# Altium schematic sheet PwrAndBias.SchDoc: Pwr And Biasing
size A3; Revision: 1; SheetNumber: 8
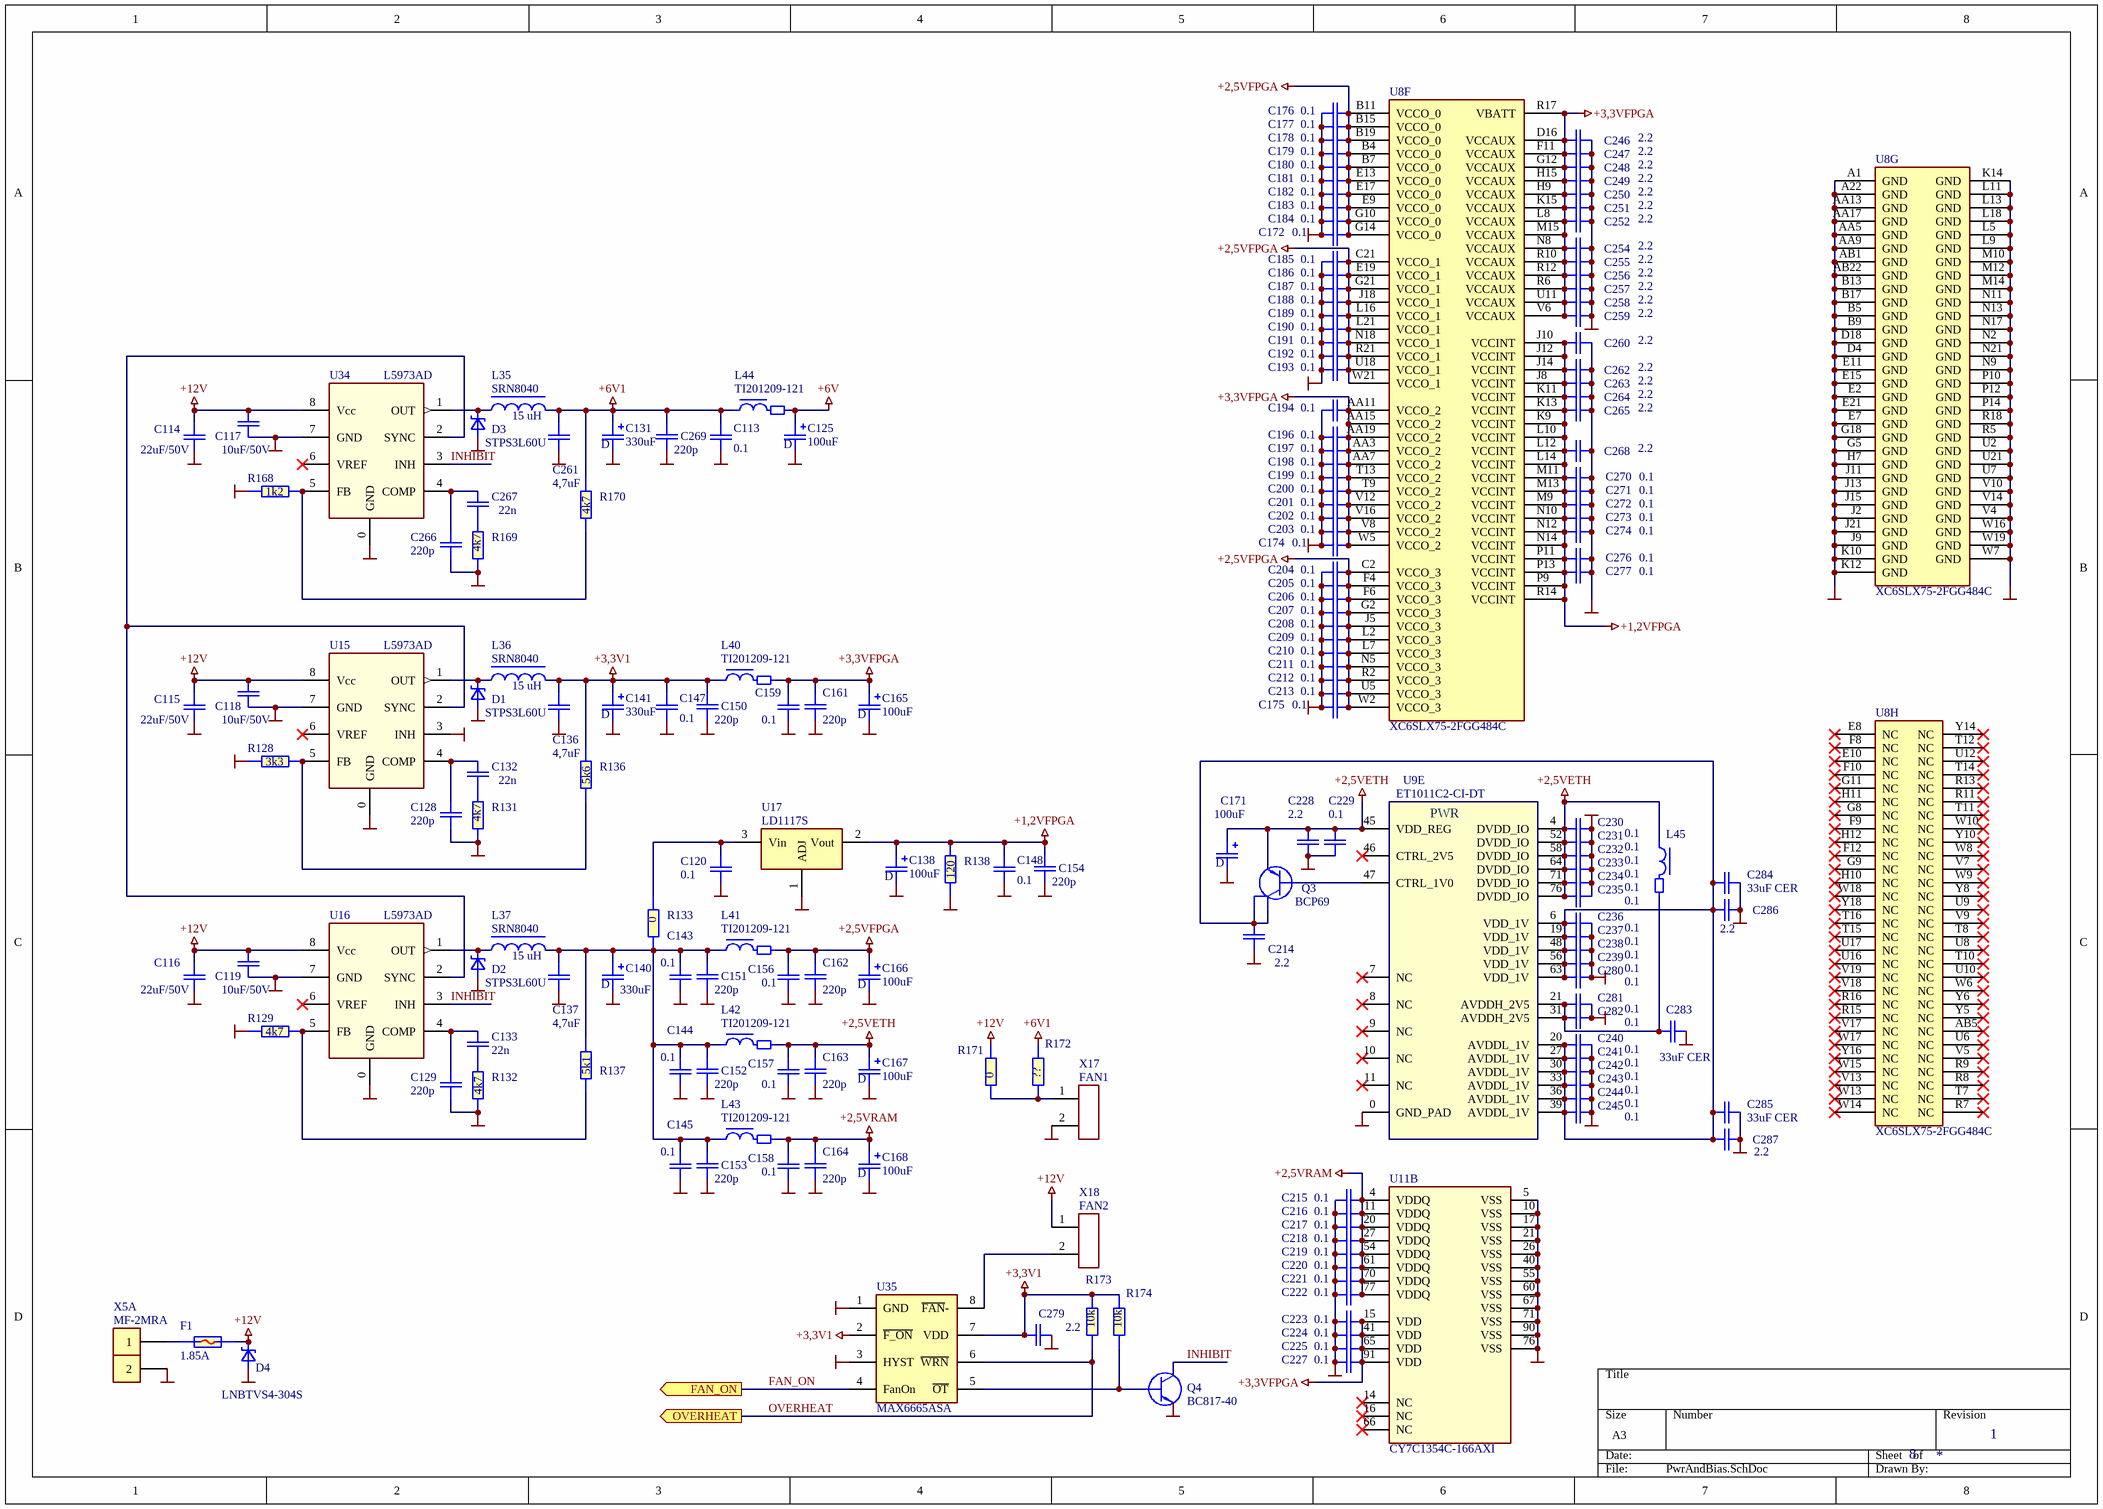
[diagram p0: PwrAndBias.SchDoc]

## Parts
C113  0.1  [C0402-Phillips]
C114  22uF/50V  [C2220]
C115  22uF/50V  [C2220]
C116  22uF/50V  [C2220]
C117  10uF/50V  [C1210_H2,5]
C118  10uF/50V  [C1210_H2,5]
C119  10uF/50V  [C1210_H2,5]
C120  0.1  [C0402-Phillips]
C125  100uF  [cd7343]
C128  220p  [C0603-PHILLIPS]
C129  220p  [C0603-PHILLIPS]
C131  330uF  [cd7343]
C132  22n  [C0603-PHILLIPS]
C133  22n  [C0603-PHILLIPS]
C136  4,7uF  [c1206]
C137  4,7uF  [c1206]
C138  100uF  [cd7343]
C140  330uF  [cd7343]
C141  330uF  [cd7343]
C143  0.1  [C0402-Phillips]
C144  0.1  [C0402-Phillips]
C145  0.1  [C0402-Phillips]
C147  0.1  [C0402-Phillips]
C148  0.1  [C0402-Phillips]
C150  220p  [C0603-PHILLIPS]
C151  220p  [C0603-PHILLIPS]
C152  220p  [C0603-PHILLIPS]
C153  220p  [C0603-PHILLIPS]
C154  220p  [C0603-PHILLIPS]
C156  0.1  [C0402-Phillips]
C157  0.1  [C0402-Phillips]
C158  0.1  [C0402-Phillips]
C159  0.1  [C0402-Phillips]
C161  220p  [C0603-PHILLIPS]
C162  220p  [C0603-PHILLIPS]
C163  220p  [C0603-PHILLIPS]
C164  220p  [C0603-PHILLIPS]
C165  100uF  [cd7343]
C166  100uF  [cd7343]
C167  100uF  [cd7343]
C168  100uF  [cd7343]
C171  100uF  [cd7343]
C172  0.1  [C0402-cirq]
C174  0.1  [C0402-cirq]
C175  0.1  [C0402-cirq]
C176  0.1  [C0402-cirq]
C177  0.1  [C0402-cirq]
C178  0.1  [C0402-cirq]
C179  0.1  [C0402-cirq]
C180  0.1  [C0402-cirq]
C181  0.1  [C0402-cirq]
C182  0.1  [C0402-cirq]
C183  0.1  [C0402-cirq]
C184  0.1  [C0402-cirq]
C185  0.1  [C0402-cirq]
C186  0.1  [C0402-cirq]
C187  0.1  [C0402-cirq]
C188  0.1  [C0402-cirq]
C189  0.1  [C0402-cirq]
C190  0.1  [C0402-cirq]
C191  0.1  [C0402-cirq]
C192  0.1  [C0402-cirq]
C193  0.1  [C0402-cirq]
C194  0.1  [C0402-cirq]
C196  0.1  [C0402-cirq]
C197  0.1  [C0402-cirq]
C198  0.1  [C0402-cirq]
C199  0.1  [C0402-cirq]
C200  0.1  [C0402-cirq]
C201  0.1  [C0402-cirq]
C202  0.1  [C0402-cirq]
C203  0.1  [C0402-cirq]
C204  0.1  [C0402-cirq]
C205  0.1  [C0402-cirq]
C206  0.1  [C0402-cirq]
C207  0.1  [C0402-cirq]
C208  0.1  [C0402-cirq]
C209  0.1  [C0402-cirq]
C210  0.1  [C0402-cirq]
C211  0.1  [C0402-cirq]
C212  0.1  [C0402-cirq]
C213  0.1  [C0402-cirq]
C214  2.2  [C0402-Phillips]
C215  0.1  [C0402-Phillips]
C216  0.1  [C0402-Phillips]
C217  0.1  [C0402-Phillips]
C218  0.1  [C0402-Phillips]
C219  0.1  [C0402-Phillips]
C220  0.1  [C0402-Phillips]
C221  0.1  [C0402-Phillips]
C222  0.1  [C0402-Phillips]
C223  0.1  [C0402-Phillips]
C224  0.1  [C0402-Phillips]
C225  0.1  [C0402-Phillips]
C227  0.1  [C0402-Phillips]
C228  2.2  [C0402-Phillips]
C229  0.1  [C0402-Phillips]
C230  0.1  [C0402-Phillips]
C231  0.1  [C0402-Phillips]
C232  0.1  [C0402-Phillips]
C233  0.1  [C0402-Phillips]
C234  0.1  [C0402-Phillips]
C235  0.1  [C0402-Phillips]
C236  0.1  [C0402-Phillips]
C237  0.1  [C0402-Phillips]
C238  0.1  [C0402-Phillips]
C239  0.1  [C0402-Phillips]
C240  0.1  [C0402-Phillips]
C241  0.1  [C0402-Phillips]
C242  0.1  [C0402-Phillips]
C243  0.1  [C0402-Phillips]
C244  0.1  [C0402-Phillips]
C245  0.1  [C0402-Phillips]
C246  2.2  [C0402-cirq]
C247  2.2  [C0402-cirq]
C248  2.2  [C0402-cirq]
C249  2.2  [C0402-cirq]
C250  2.2  [C0402-cirq]
C251  2.2  [C0402-cirq]
C252  2.2  [C0402-cirq]
C254  2.2  [C0402-cirq]
C255  2.2  [C0402-cirq]
C256  2.2  [C0402-cirq]
C257  2.2  [C0402-cirq]
C258  2.2  [C0402-cirq]
C259  2.2  [C0402-cirq]
C260  2.2  [C0402-cirq]
C261  4,7uF  [c1206]
C262  2.2  [C0402-cirq]
C263  2.2  [C0402-cirq]
C264  2.2  [C0402-cirq]
C265  2.2  [C0402-cirq]
C266  220p  [C0603-PHILLIPS]
C267  22n  [C0603-PHILLIPS]
C268  2.2  [C0402-cirq]
C269  220p  [C0603-PHILLIPS]
C270  0.1  [C0402-cirq]
C271  0.1  [C0402-cirq]
C272  0.1  [C0402-cirq]
C273  0.1  [C0402-cirq]
C274  0.1  [C0402-cirq]
C276  0.1  [C0402-cirq]
C277  0.1  [C0402-cirq]
C279  2.2  [C0402-Phillips]
C280  0.1  [C0402-Phillips]
C281  0.1  [C0402-Phillips]
C282  0.1  [C0402-Phillips]
C283  33uF CER  [C0805-Phillips]
C284  33uF CER  [C0805-Phillips]
C285  33uF CER  [C0805-Phillips]
C286  2.2  [C0402-Phillips]
C287  2.2  [C0402-Phillips]
D1  STPS3L60U  [SMB]
D2  STPS3L60U  [SMB]
D3  STPS3L60U  [SMB]
D4  LNBTVS4-304S  [SMC]
F1  1.85A  [FUSE2920]
L35  15 uH  [SRN8040]
L36  15 uH  [SRN8040]
L37  15 uH  [SRN8040]
L40  TI201209-121  [TI2012-Phillips]
L41  TI201209-121  [TI2012-Phillips]
L42  TI201209-121  [TI2012-Phillips]
L43  TI201209-121  [TI2012-Phillips]
L44  TI201209-121  [TI2012-Phillips]
L45  TI160808U601  [Ti160808-Phillips]  (value not drawn)
Q3  BCP69  [SOT-223]
Q4  BC817-40  [SOT23-Philips]
R128  3k3  [R0603-PHILLIPS]
R129  4k7  [R0603-PHILLIPS]
R131  4k7  [R0603-PHILLIPS]
R132  4k7  [R0603-PHILLIPS]
R133  0  [R0603-PHILLIPS]
R136  5k6  [R0603-PHILLIPS]
R137  5k1  [R0603-PHILLIPS]
R138  120  [R0603-PHILLIPS]
R168  1k2  [R0603-PHILLIPS]
R169  4k7  [R0603-PHILLIPS]
R170  4k7  [R0603-PHILLIPS]
R171  0  [R0603-PHILLIPS]
R172  ??  [R0603-PHILLIPS]
R173  10k  [R0603-PHILLIPS]
R174  10k  [R0603-PHILLIPS]
U8  XC6SLX75-2FGG484C  [FBGA484]  (parts F,G,H of 8)
U9  ET1011C2-CI-DT  [QFN-84(10x10/0/4mm)with_pad]  (part E of 5)
U11  CY7C1354C-166AXI  [QFP-10020X14/0.65]]  (part B of 2)
U15  L5973AD  [SOIC8 - BackGND - 0.4mm dia]
U16  L5973AD  [SOIC8 - BackGND - 0.4mm dia]
U17  LD1117S  [SOT-223-1]
U34  L5973AD  [SOIC8 - BackGND - 0.4mm dia]
U35  MAX6665ASA  [SO-8]
X5  MF-2MRA  [MF-2MRA]  (parts A,B of 2)
X17  FAN1  [WF-2]
X18  FAN2  [WF-2]

## Ports
FAN_ON (out), OVERHEAT (out)

## Nets
+1,2VFPGA: C138.1(+) C148.1 C154.1 C260.1 C262.1 C263.1 C264.1 C265.1 C268.1 C270.1 C271.1 C272.1 C273.1 C274.1 C276.1 C277.1 R138.1 U8.J8(VCCINT) U8.J10(VCCINT) U8.J12(VCCINT) U8.J14(VCCINT) U8.K9(VCCINT) U8.K11(VCCINT) U8.K13(VCCINT) U8.L10(VCCINT) U8.L12(VCCINT) U8.L14(VCCINT) U8.M9(VCCINT) U8.M11(VCCINT) U8.M13(VCCINT) U8.N10(VCCINT) U8.N12(VCCINT) U8.N14(VCCINT) U8.P9(VCCINT) U8.P11(VCCINT) U8.P13(VCCINT) U8.R14(VCCINT) U17.2(Vout)
+2,5VETH: C157.1 C163.1 C167.1(+) C171.1(+) C228.2 C229.1 C230.1 C231.1 C232.1 C233.1 C234.1 C235.1 L42.2 L45.1 Q3.3(E) U9.4(DVDD_IO) U9.45(VDD_REG) U9.52(DVDD_IO) U9.58(DVDD_IO) U9.64(DVDD_IO) U9.71(DVDD_IO) U9.76(DVDD_IO)
+2,5VFPGA: C156.1 C162.1 C166.1(+) C172.2 C175.2 C176.2 C177.2 C178.2 C179.2 C180.2 C181.2 C182.2 C183.2 C184.2 C185.2 C186.2 C187.2 C188.2 C189.2 C190.2 C191.2 C192.2 C193.2 C204.2 C205.2 C206.2 C207.2 C208.2 C209.2 C210.2 C211.2 C212.2 C213.2 L41.2 U8.B4(VCCO_0) U8.B7(VCCO_0) U8.B11(VCCO_0) U8.B15(VCCO_0) U8.B19(VCCO_0) U8.C2(VCCO_3) U8.C21(VCCO_1) U8.E9(VCCO_0) U8.E13(VCCO_0) U8.E17(VCCO_0) U8.E19(VCCO_1) U8.F4(VCCO_3) U8.F6(VCCO_3) U8.G2(VCCO_3) U8.G10(VCCO_0) U8.G14(VCCO_0) U8.G21(VCCO_1) U8.J5(VCCO_3) U8.J18(VCCO_1) U8.L2(VCCO_3) U8.L7(VCCO_3) U8.L16(VCCO_1) U8.L21(VCCO_1) U8.N5(VCCO_3) U8.N18(VCCO_1) U8.R2(VCCO_3) U8.R21(VCCO_1) U8.U5(VCCO_3) U8.U18(VCCO_1) U8.W2(VCCO_3) U8.W21(VCCO_1)
+2,5VRAM: C158.1 C164.1 C168.1(+) C215.2 C216.2 C217.2 C218.2 C219.2 C220.2 C221.2 C222.2 L43.2 U11.4(VDDQ) U11.11(VDDQ) U11.20(VDDQ) U11.27(VDDQ) U11.54(VDDQ) U11.61(VDDQ) U11.70(VDDQ) U11.77(VDDQ)
+3,3V1: C136.1 C141.1(+) C147.1 C150.1 C279.1 L36.2 L40.1 R136.1 R173.1 R174.1 U35.2(~{F_ON}) U35.7(VDD)
+3,3VFPGA: C159.1 C161.1 C165.1(+) C174.2 C194.2 C196.2 C197.2 C198.2 C199.2 C200.2 C201.2 C202.2 C203.2 C223.2 C224.2 C225.2 C227.2 C246.1 C247.1 C248.1 C249.1 C250.1 C251.1 C252.1 C254.1 C255.1 C256.1 C257.1 C258.1 C259.1 L40.2 U8.AA3(VCCO_2) U8.AA7(VCCO_2) U8.AA11(VCCO_2) U8.AA15(VCCO_2) U8.AA19(VCCO_2) U8.D16(VCCAUX) U8.F11(VCCAUX) U8.G12(VCCAUX) U8.H9(VCCAUX) U8.H15(VCCAUX) U8.K15(VCCAUX) U8.L8(VCCAUX) U8.M15(VCCAUX) U8.N8(VCCAUX) U8.R6(VCCAUX) U8.R10(VCCAUX) U8.R12(VCCAUX) U8.R17(VBATT) U8.T9(VCCO_2) U8.T13(VCCO_2) U8.U11(VCCAUX) U8.V6(VCCAUX) U8.V8(VCCO_2) U8.V12(VCCO_2) U8.V16(VCCO_2) U8.W5(VCCO_2) U11.15(VDD) U11.41(VDD) U11.65(VDD) U11.91(VDD)
+6V: C125.1(+) L44.2
+6V1: C113.1 C131.1(+) C261.1 C269.1 L35.2 L44.1 R170.1 R172.1
+12V: C114.1 C115.1 C116.1 C117.1 C118.1 C119.1 D4.2(C) F1.2 R171.1 U15.8(Vcc) U16.8(Vcc) U34.8(Vcc) X18.1
GND: C113.2 C114.2 C115.2 C116.2 C117.2 C118.2 C119.2 C120.2 C125.2(-) C128.2 C129.2 C131.2(-) C136.2 C137.2 C138.2(-) C140.2(-) C141.2(-) C143.2 C144.2 C145.2 C147.2 C148.2 C150.2 C151.2 C152.2 C153.2 C154.2 C156.2 C157.2 C158.2 C159.2 C161.2 C162.2 C163.2 C164.2 C165.2(-) C166.2(-) C167.2(-) C168.2(-) C171.2(-) C172.1 C174.1 C175.1 C176.1 C177.1 C178.1 C179.1 C180.1 C181.1 C182.1 C183.1 C184.1 C185.1 C186.1 C187.1 C188.1 C189.1 C190.1 C191.1 C192.1 C193.1 C194.1 C196.1 C197.1 C198.1 C199.1 C200.1 C201.1 C202.1 C203.1 C204.1 C205.1 C206.1 C207.1 C208.1 C209.1 C210.1 C211.1 C212.1 C213.1 C214.1 C215.1 C216.1 C217.1 C218.1 C219.1 C220.1 C221.1 C222.1 C223.1 C224.1 C225.1 C227.1 C228.1 C229.2 C230.2 C231.2 C232.2 C233.2 C234.2 C235.2 C236.2 C237.2 C238.2 C239.2 C240.2 C241.2 C242.2 C243.2 C244.2 C245.2 C246.2 C247.2 C248.2 C249.2 C250.2 C251.2 C252.2 C254.2 C255.2 C256.2 C257.2 C258.2 C259.2 C260.2 C261.2 C262.2 C263.2 C264.2 C265.2 C266.2 C268.2 C269.2 C270.2 C271.2 C272.2 C273.2 C274.2 C276.2 C277.2 C279.2 C280.2 C281.2 C282.2 C283.2 C284.2 C285.2 C286.1 C287.1 D1.2(A) D2.2(A) D3.2(A) D4.1(A) Q4.2(E) R128.1 R129.1 R131.2 R132.2 R138.2 R168.1 R169.2 U8.A1(GND) U8.A22(GND) U8.AA5(GND) U8.AA9(GND) U8.AA13(GND) U8.AA17(GND) U8.AB1(GND) U8.AB22(GND) U8.B5(GND) U8.B9(GND) U8.B13(GND) U8.B17(GND) U8.D4(GND) U8.D18(GND) U8.E2(GND) U8.E7(GND) U8.E11(GND) U8.E15(GND) U8.E21(GND) U8.G5(GND) U8.G18(GND) U8.H7(GND) U8.J2(GND) U8.J9(GND) U8.J11(GND) U8.J13(GND) U8.J15(GND) U8.J21(GND) U8.K10(GND) U8.K12(GND) U8.K14(GND) U8.L5(GND) U8.L9(GND) U8.L11(GND) U8.L13(GND) U8.L18(GND) U8.M10(GND) U8.M12(GND) U8.M14(GND) U8.N2(GND) U8.N9(GND) U8.N11(GND) U8.N13(GND) U8.N17(GND) U8.N21(GND) U8.P10(GND) U8.P12(GND) U8.P14(GND) U8.R5(GND) U8.R18(GND) U8.U2(GND) U8.U7(GND) U8.U21(GND) U8.V4(GND) U8.V10(GND) U8.V14(GND) U8.W7(GND) U8.W16(GND) U8.W19(GND) U9.0(GND_PAD) U11.5(VSS) U11.10(VSS) U11.17(VSS) U11.21(VSS) U11.26(VSS) U11.40(VSS) U11.55(VSS) U11.60(VSS) U11.67(VSS) U11.71(VSS) U11.76(VSS) U11.90(VSS) U15.0(GND) U15.3(INH) U15.7(GND) U16.0(GND) U16.7(GND) U17.1(ADJ) U34.0(GND) U34.7(GND) U35.1(GND) U35.3(HYST) X5.2 X17.2
FAN_ON: U35.4(FanOn) ; port FAN_ON
INHIBIT: Q4.3(C) U16.3(INH) U34.3(INH)
OVERHEAT: R173.2 U35.6(~{WRN}) ; port OVERHEAT
NetC120_1: C120.1 R133.2 U17.3(Vin)
NetC128_1: C128.1 C132.1 U15.4(COMP)
NetC129_1: C129.1 C133.1 U16.4(COMP)
NetC132_2: C132.2 R131.1
NetC133_2: C133.2 R132.1
NetC137_1: C137.1 C140.1(+) C143.1 C144.1 C145.1 C151.1 C152.1 C153.1 L37.2 L41.1 L42.1 L43.1 R133.1 R137.1
NetC214_2: C214.2 C236.1 C237.1 C238.1 C239.1 C240.1 C241.1 C242.1 C243.1 C244.1 C245.1 C280.1 C284.1 C285.1 C286.2 C287.2 Q3.2(C) Q3.4(C) U9.6(VDD_1V) U9.19(VDD_1V) U9.20(AVDDL_1V) U9.27(AVDDL_1V) U9.30(AVDDL_1V) U9.33(AVDDL_1V) U9.36(AVDDL_1V) U9.39(AVDDL_1V) U9.48(VDD_1V) U9.56(VDD_1V) U9.63(VDD_1V)
NetC266_1: C266.1 C267.1 U34.4(COMP)
NetC267_2: C267.2 R169.1
NetC281_1: C281.1 C282.1 C283.1 L45.2 U9.21(AVDDH_2V5) U9.31(AVDDH_2V5)
NetD1_1: D1.1(C) L36.1 U15.1(OUT)
NetD2_1: D2.1(C) L37.1 U16.1(OUT)
NetD3_1: D3.1(C) L35.1 U34.1(OUT)
NetF1_1: F1.1 X5.1
NetQ3_1: Q3.1(B) U9.47(CTRL_1V0)
NetQ4_1: Q4.1(B) R174.2 U35.5(~{OT})
NetR128_2: R128.2 R136.2 U15.5(FB)
NetR129_2: R129.2 R137.2 U16.5(FB)
NetR168_2: R168.2 R170.2 U34.5(FB)
NetR171_2: R171.2 R172.2 X17.1
NetU15_2: U15.2(SYNC) U16.2(SYNC) U34.2(SYNC)
NetU35_8: U35.8(~{FAN}-) X18.2

Not connected (* = marked no-connect by the designer): U8 AB5(NC)* E8(NC)* E10(NC)* F8(NC)* F9(NC)* F10(NC)* F12(NC)* G8(NC)* G9(NC)* G11(NC)* H10(NC)* H11(NC)* H12(NC)* R7(NC)* R8(NC)* R9(NC)* R11(NC)* R13(NC)* R15(NC)* R16(NC)* T7(NC)* T8(NC)* T10(NC)* T11(NC)* T12(NC)* T14(NC)* T15(NC)* T16(NC)* U6(NC)* U8(NC)* U9(NC)* U10(NC)* U12(NC)* U16(NC)* U17(NC)* V5(NC)* V7(NC)* V9(NC)* V13(NC)* V17(NC)* V18(NC)* V19(NC)* W6(NC)* W8(NC)* W9(NC)* W10(NC)* W13(NC)* W14(NC)* W15(NC)* W17(NC)* W18(NC)* Y5(NC)* Y6(NC)* Y8(NC)* Y10(NC)* Y14(NC)* Y16(NC)* Y18(NC)*; U9 7(NC)* 8(NC)* 9(NC)* 10(NC)* 11(NC)* 46(CTRL_2V5)*; U11 14(NC)* 16(NC)* 66(NC)*; U15 6(VREF)*; U16 6(VREF)*; U34 6(VREF)*

## Notes on the sheet
- (in symbol CD7343) D
- (in symbol ET1011C2-CI-DT, part E) PWR

## Library data of the parts
C113 C120 C143-C145 C147 C148 C156-C159 C172 C174-C194 C196-C225 C227-C252 C254-C260 C262-C265 C268 C270-C274 C276 C277 C279-C282 C286 C287 = C0402: Конденсатор; Manufacturer: MURATA; Tolerance: 20%; Name: SMD0402; U/P/TKE: Y5V
  C113 C120 C143-C145 C147 C148 C156-C159 C172 C174-C194 C196-C213 C215-C225 C227 C229-C245 C270-C274 C276 C277 C280-C282: Value: 0.1
  C214 C228 C246-C252 C254-C260 C262-C265 C268 C279 C286 C287: Value: 2.2
C114-C116 = C2220: Конденсатор; Manufacturer: TDK; Name: C5750Y5V1H226Z; U/P/TKE: Y5V; Value: 22uF/50V
C117-C119 = C1210_H2,5: Конденсатор; Manufacturer: TAIYO YUDEN; Tolerance: 20%; Name: UMK325 BJ106MM; U/P/TKE: X5R; Value: 10uF/50V
C125 C138 C165-C168 C171 = CD7343: Конденсатор; Manufacturer: SPRAGUE; Name: CASE-D; U/P/TKE: 16V; Value: 100uF
C128 C129 C150-C154 C161-C164 C266 C269 = C0603: Конденсатор; Manufacturer: MURATA; Tolerance: 20%; Name: SMD0603; U/P/TKE: NP0; Value: 220p
C131 C140 C141 = CD7343: Конденсатор; Manufacturer: Kemet; Name: CASE-D; U/P/TKE: 10V; Value: 330uF
C132 C133 C267 = C0603: Конденсатор; Manufacturer: MURATA; Tolerance: 20%; Name: SMD0603; U/P/TKE: X7R; Value: 22n
C136 C137 C261 = C1206: Конденсатор; Manufacturer: Taiyo Yuden; Tolerance: 10%; Name: UMK316AB7475KL-T; U/P/TKE: Y5V 50V; Value: 4,7uF
C283-C285 = C0805: Конденсатор; Manufacturer: MURATA; Tolerance: 20%; Name: SMD0805; U/P/TKE: Y5R; Value: 33uF CER
D1-D3 = B3x0B: Диод Шоттки; Manufacturer: ST; Name: STPS3L60U
D4 = STPS3L40S: Диод; Manufacturer: ST; Misc: TVS 30V 2.5kW; Name: LNBTVS4-304S
F1 = FUSE_PTC: FUSE PTC resetable; Manufacturer: Bel Fuse; Name: 0ZCD0185FF2C; U/P/TKE: 33V; Value: 1.85A
L35-L37 = L-SRN8040: Индуктивность; Manufacturer: BOURNS; Name: SRN8040; Value: 15 uH
L40-L44 = TI2012_1: Дроссель ЭМС; Manufacturer: MURATA; Name: TI201209-121; Value: *
L45 = TI160808: Дроссель ЭМС; Manufacturer: MURATA; Name: TI160808U601; Value: *
Q3 = BCP69: Транзистор; Manufacturer: INFINEON; Name: BCP69
Q4 = BC 817: Транзистор; Manufacturer: Philips; Name: BC817-40
R128 R129 R131-R133 R136-R138 R168-R174 = R0603: Резистор; Manufacturer: YAGEO; Tolerance: 5%; Name: SMD0603; U/P/TKE: 0.1W
  R128: Value: 3k3
  R129 R131 R132 R169 R170: Value: 4k7
  R133 R171: Value: 0
  R136: Value: 5k6
  R137: Value: 5k1
  R138: Value: 120
  R168: Value: 1k2
  R172: Value: ??
  R173 R174: Value: 10k
U8 = XC6SLX75-2FGG484C: Spartan-6 LX 1.2V FPGA, 270 User I/Os, 484-Ball Fine-Pitch BGA (1.0mm Pitch), Speed Grade 2, Commercial Grade, Pb-Free; Manufacturer: Xilinx; Published: 1-Jul-2010; Supplier 1: Digi-Key; Supplier Part Number 1: XC6SLX75-2FGG484C-ND; ComponentLink1Description: Manufacturer Link; ComponentLink1URL: http://www.xilinx.com; ComponentLink2Description: Spartan-6 Datasheet; ComponentLink2URL: http://www.xilinx.com/support/documentation/data_sheets/ds160.pdf; ComponentLink3Description: Spartan-6 Documents; ComponentLink3URL: http://www.xilinx.com/support/documentation/spartan-6.htm; ComponentLink4Description: Xilinx.com Home; ComponentLink4URL: http://www.xilinx.com; Misc: Spartan-6 LX 1.2V FPGA; Name: XC6SLX75-2FGG484C
U9 = ET1011C2-CI-DT: Микросхема; Manufacturer: LSI; PDF: d:\Proj\Components\LSI\Si5330.pdf; Misc: Gigabit Ethernet Transceiver; Name: ET1011C2-CI-DT
U11 = CY7C1354C-166AXI: Микросхема; Manufacturer: Cypress; Misc: Pipelined SRAM with NoBL™ Architecture; PDF: d:\Proj\Components\Cypress\CY7C1354C_CY7C1356C2.pdf; Name: CY7C1354C-166AXI
U15 U16 U34 = L5973D: Микросхема; Manufacturer: ST; Misc: step down switching regulator; Swap: No; PDF: d:\Proj\Components\ST\L5973D(stepdown2,5A)_ST.pdf; Name: L5973AD
U17 = LD1117ADJ: Микросхема; Manufacturer: STMicro; Swap: No; Name: LD1117S
U35 = MAX6665ASA: Микросхема; Manufacturer: Maxim; Swap: No; PDF: d:\Proj\Components\Maxim\MAX6665.pdf; Misc: Fan Controller/Driver; Name: MAX6665ASA
X5 = MF-2MRA: Разъем; Manufacturer: BM; Name: MF-2MRA
X17 X18 = WF-2: Разъем; Manufacturer: BM
  X17: Name: FAN1
  X18: Name: FAN2